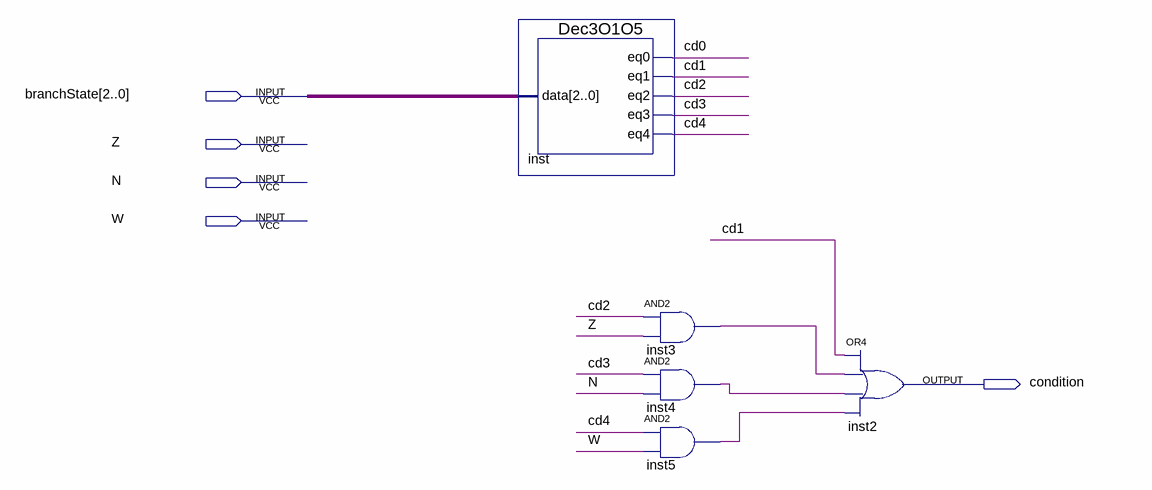
[diagram p0: schematic sheet]
// Quartus schematic ConditionChecker.bdf as structural Verilog: 5 symbols, 5 pins
module ConditionChecker (
  input  [2:0] branchState,
  input  Z,
  input  N,
  input  W,
  output condition
);

  wire cd0, cd1, cd2, cd3, cd4, inst3_out, inst4_out, inst5_out;

  Dec3O1O5 inst (.data(branchState), .eq0(cd0), .eq1(cd1), .eq2(cd2), .eq3(cd3), .eq4(cd4));
  and inst3 (inst3_out, cd2, Z);
  and inst4 (inst4_out, cd3, N);
  and inst5 (inst5_out, cd4, W);
  or inst2 (condition, cd1, inst3_out, inst4_out, inst5_out);
endmodule
